# Altium schematic sheet Connector-Harness.SchDoc
size A4; SheetNumber: 4; SheetTotal: 4
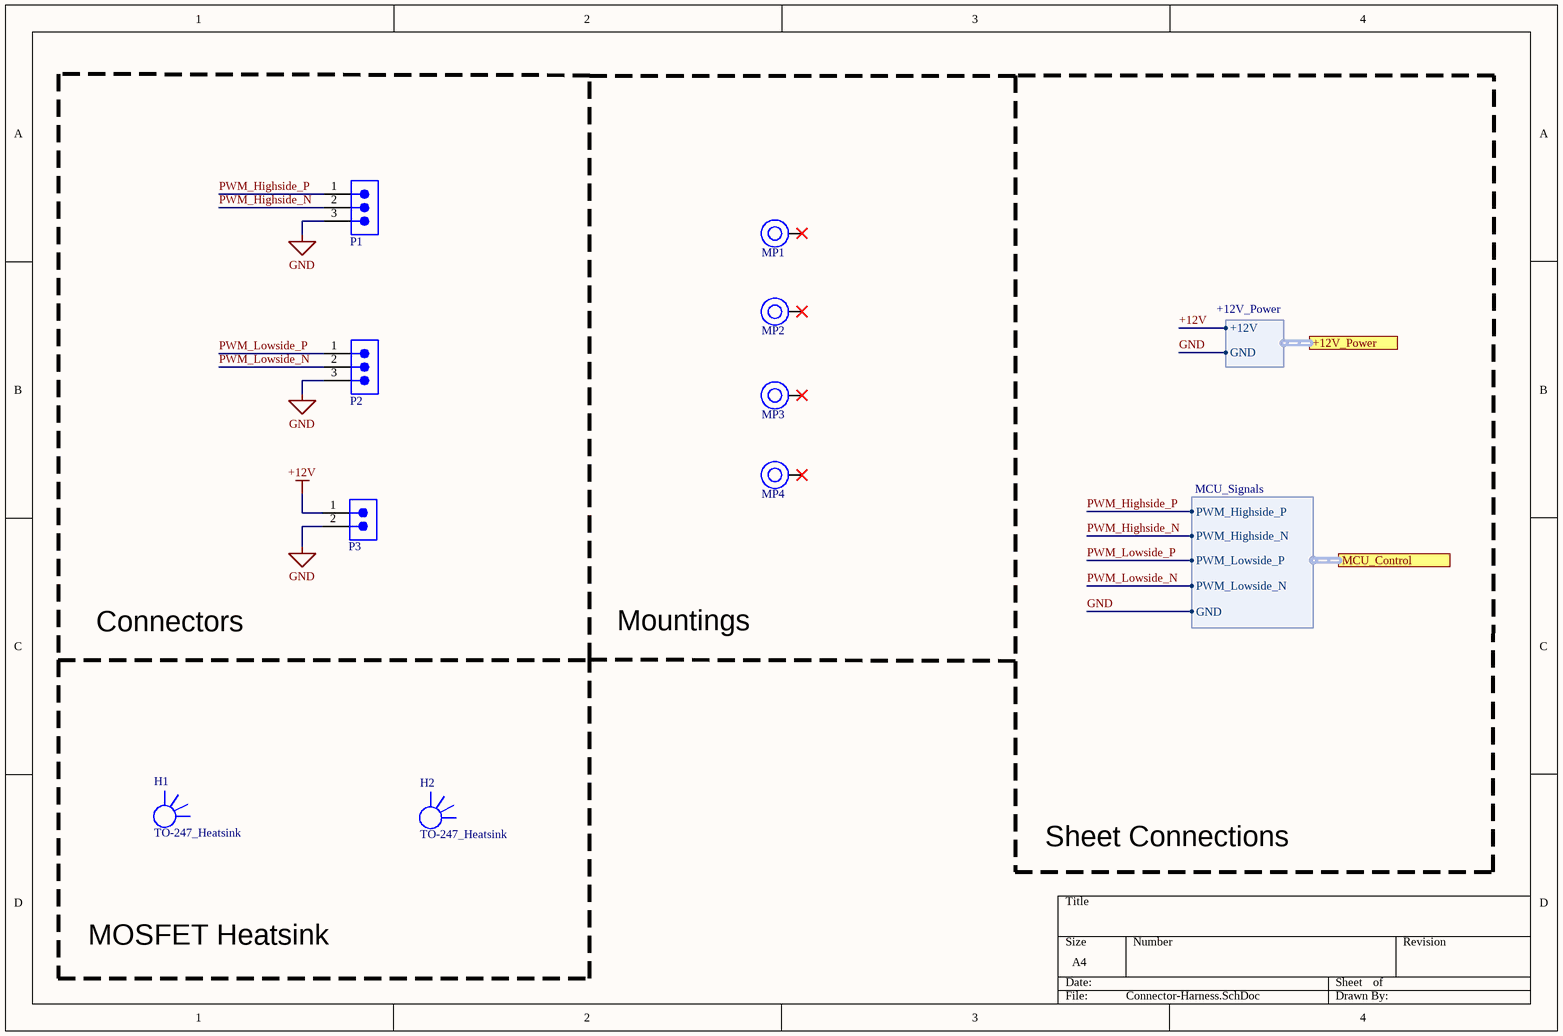
[diagram p0: Connector-Harness.SchDoc]

## Parts
H1  TO-247_Heatsink  [Heatsink]
H2  TO-247_Heatsink  [Heatsink]
MP1  Hole 3.3mm x 9mm  [78614090960]  (value not drawn)
MP2  Hole 3.3mm x 9mm  [78614090960]  (value not drawn)
MP3  Hole 3.3mm x 9mm  [78614090960]  (value not drawn)
MP4  Hole 3.3mm x 9mm  [78614090960]  (value not drawn)
P1  61900311121  [61900311121]  (value not drawn)
P2  61900311121  [61900311121]  (value not drawn)
P3  61900211121  [61900211121]  (value not drawn)

## Blocks framed on the sheet
Connectors: P1-P3

## Ports
+12V_Power (harness +12V_Power), MCU_Control (harness MCU_Signals)

## Harnesses
+12V_Power: +12V, GND
MCU_Signals: PWM_Highside_P, PWM_Highside_N, PWM_Lowside_P, PWM_Lowside_N, GND

## Nets
+12V: P3.1 ; port +12V_Power.+12V
GND: P1.3 P2.3 P3.2 ; port +12V_Power.GND, port MCU_Control.GND
PWM_Highside_N: P1.2 ; port MCU_Control.PWM_Highside_N
PWM_Highside_P: P1.1 ; port MCU_Control.PWM_Highside_P
PWM_Lowside_N: P2.2 ; port MCU_Control.PWM_Lowside_N
PWM_Lowside_P: P2.1 ; port MCU_Control.PWM_Lowside_P

Not connected (* = marked no-connect by the designer): MP1 1*; MP2 1*; MP3 1*; MP4 1*

## Notes on the sheet
- Mountings
- Sheet Connections
- MOSFET Heatsink

## Library data of the parts
MP1-MP4 = 78614090960: WA-SMSA SMT Spacer Studs Automotive, OD 6mm, ID 4.2mm, Hole 3.3mm x 9mm; Manufacturer: Wurth Elektronik; Surface: Tin; Solder Cream Thickness Min: 150um; Manufacturer Part Number: 78614090960; Category: SMT Spacers; Match Code: WA-SMSA; ComponentLink1Description: Website Link; ComponentLink1URL: https://www.we-online.com/redexpert/article/78614090960?ad; ComponentLink2Description: Datasheet Link; ComponentLink2URL: https://www.we-online.com/redexpert/spec/78614090960?ad; Mount: Surface Mount; Operating Temperature Max: 150°C; Operating Temperature Min: -55°C; Packaging: Tape and Reel; Height: 9mm; Automotive: Yes; Inside Diameter: 4.2mm; Hole Diameter: 3.3mm; Material: Steel; Outside Diameter: 6mm
P1 P2 = 61900311121: WR-WTB THT Male Vertical Locking Header, pitch 2.54mm, 3pins; Manufacturer: Wurth Elektronik; Contact Resistance: 20mOhm; Rated Current: 3A; Working Voltage: 250VAC; Withstanding Voltage: 1000VAC; Manufacturer Part Number: 61900311121; Category: Wire-to-Board Connectors; Match Code: WR-WTB; ComponentLink1Description: Website Link; ComponentLink1URL: https://www.we-online.com/redexpert/article/61900311121?ad; ComponentLink2Description: Datasheet Link; ComponentLink2URL: https://www.we-online.com/redexpert/spec/61900311121?ad; Mount: Through Hole; Operating Temperature Max: 105°C; Operating Temperature Min: -40°C; Packaging: Bag; Length: 7.62mm; Width: 5.8mm; Height: 11.5mm; Gender: Male; Number of Pins: 3; Number of Rows: 1; Orientation: Vertical; Pitch: 2.54mm
P3 = 61900211121: WR-WTB THT Male Vertical Locking Header, pitch 2.54mm, 2pins; Manufacturer: Wurth Elektronik; Contact Resistance: 20mOhm; Rated Current: 3A; Working Voltage: 250VAC; Withstanding Voltage: 1000VAC; Manufacturer Part Number: 61900211121; Category: Wire-to-Board Connectors; Match Code: WR-WTB; ComponentLink1Description: Website Link; ComponentLink1URL: https://www.we-online.com/redexpert/article/61900211121?ad; ComponentLink2Description: Datasheet Link; ComponentLink2URL: https://www.we-online.com/redexpert/spec/61900211121?ad; Mount: Through Hole; Operating Temperature Max: 105°C; Operating Temperature Min: -40°C; Packaging: Bag; Length: 5.08mm; Width: 5.8mm; Height: 11.5mm; Gender: Male; Number of Pins: 2; Number of Rows: 1; Orientation: Vertical; Pitch: 2.54mm